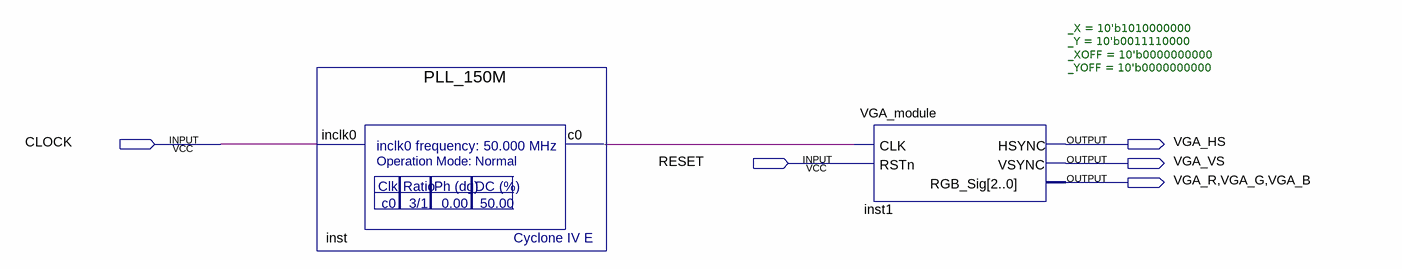
[diagram p0: schematic sheet]
// Quartus schematic VGA_test_bdf.bdf as structural Verilog: 2 symbols, 5 pins
module VGA_test_bdf (
  input  CLOCK,
  input  RESET,
  output VGA_HS,
  output VGA_VS,
  output VGA_R,
  output VGA_G,
  output VGA_B
);

  wire inst_c0;

  PLL_150M inst (.inclk0(CLOCK), .c0(inst_c0));
  VGA_module #(._X(10'b1010000000), ._Y(10'b0011110000), ._XOFF(10'b0000000000), ._YOFF(10'b0000000000)) inst1 (
    .CLK(inst_c0), .RSTn(RESET), .HSYNC(VGA_HS), .VSYNC(VGA_VS), .RGB_Sig({VGA_R, VGA_G, VGA_B}));
endmodule
